# Altium schematic sheet Ring 2.SchDoc
size A; SheetNumber: 10; SheetTotal: 30
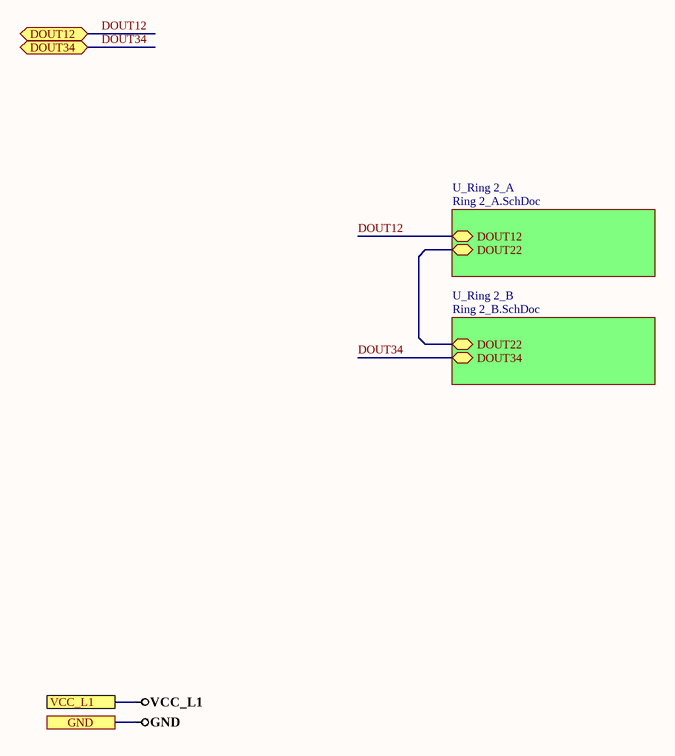
[diagram p0: Ring 2.SchDoc]

## Sub-sheets
U_Ring 2_A = Ring 2_A.SchDoc: DOUT22 (bidir), DOUT12 (bidir)
U_Ring 2_B = Ring 2_B.SchDoc: DOUT22 (bidir), DOUT34 (bidir)

## Ports
DOUT12 (bidir), DOUT34 (bidir), GND, VCC_L1

## Nets
GND: port GND
VCC_L1: port VCC_L1
DOUT12: port DOUT12, sheet U_Ring 2_A/DOUT12
DOUT34: port DOUT34, sheet U_Ring 2_B/DOUT34
(unnamed): sheet U_Ring 2_A/DOUT22, sheet U_Ring 2_B/DOUT22